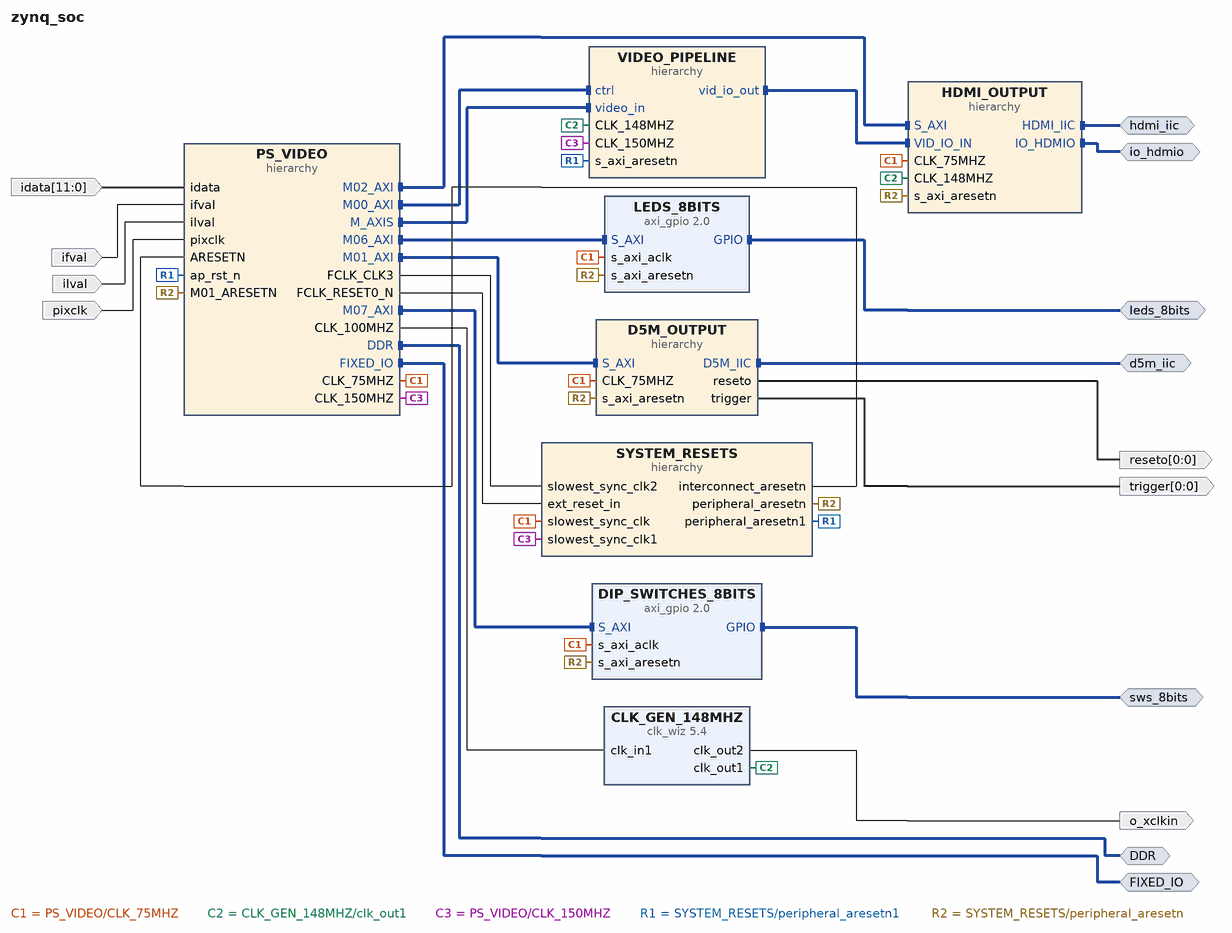
[diagram p0: block diagram of the top level]
# Vivado block design zynq_soc, xc7z020clg484-1, Vivado 2017.2
create_bd_design zynq_soc

create_bd_intf_port -mode Master -vlnv xilinx.com:interface:ddrx_rtl:1.0 DDR
create_bd_intf_port -mode Master -vlnv xilinx.com:display_processing_system7:fixedio_rtl:1.0 FIXED_IO
create_bd_intf_port -mode Master -vlnv xilinx.com:interface:iic_rtl:1.0 d5m_iic
create_bd_intf_port -mode Master -vlnv xilinx.com:interface:iic_rtl:1.0 hdmi_iic
create_bd_intf_port -mode Master -vlnv avnet.com:interface:avnet_hdmi_rtl:1.0 io_hdmio
create_bd_intf_port -mode Master -vlnv xilinx.com:interface:gpio_rtl:1.0 leds_8bits
create_bd_intf_port -mode Master -vlnv xilinx.com:interface:gpio_rtl:1.0 sws_8bits
create_bd_port -dir O o_xclkin
create_bd_port -dir O -from 0 -to 0 reseto
create_bd_port -dir O -from 0 -to 0 trigger
create_bd_port -dir I -from 11 -to 0 idata
create_bd_port -dir I ifval
create_bd_port -dir I ilval
create_bd_port -dir I pixclk

create_bd_cell -type ip -vlnv xilinx.com:ip:clk_wiz:5.4 CLK_GEN_148MHZ
set_property -dict [list \
  CONFIG.ENABLE_CLOCK_MONITOR false \
  CONFIG.PRIMITIVE MMCM \
  CONFIG.CLKOUT2_USED true \
  CONFIG.NUM_OUT_CLKS 2 \
  CONFIG.CLKOUT1_REQUESTED_OUT_FREQ 148.500 \
  CONFIG.CLKOUT2_REQUESTED_OUT_FREQ 24.000 \
  CONFIG.USE_LOCKED false \
  CONFIG.USE_RESET false \
  CONFIG.MMCM_DIVCLK_DIVIDE 3 \
  CONFIG.MMCM_CLKFBOUT_MULT_F 24.500 \
  CONFIG.MMCM_CLKOUT0_DIVIDE_F 5.500 \
  CONFIG.MMCM_CLKOUT1_DIVIDE 34 \
  CONFIG.CLK_IN1_BOARD_INTERFACE Custom \
  CONFIG.CLK_IN2_BOARD_INTERFACE Custom \
  CONFIG.RESET_BOARD_INTERFACE Custom \
  CONFIG.CLKOUT1_JITTER 202.854 \
  CONFIG.CLKOUT1_PHASE_ERROR 235.784 \
  CONFIG.CLKOUT2_JITTER 299.004 \
  CONFIG.CLKOUT2_PHASE_ERROR 235.784 \
] [get_bd_cells CLK_GEN_148MHZ]
create_bd_cell -type hier D5M_OUTPUT
create_bd_cell -type ip -vlnv xilinx.com:ip:axi_gpio:2.0 DIP_SWITCHES_8BITS
set_property -dict {CONFIG.USE_BOARD_FLOW true CONFIG.GPIO_BOARD_INTERFACE sws_8bits} [get_bd_cells DIP_SWITCHES_8BITS]
create_bd_cell -type hier HDMI_OUTPUT
create_bd_cell -type ip -vlnv xilinx.com:ip:axi_gpio:2.0 LEDS_8BITS
set_property -dict {CONFIG.USE_BOARD_FLOW true CONFIG.GPIO_BOARD_INTERFACE leds_8bits} [get_bd_cells LEDS_8BITS]
create_bd_cell -type hier PS_VIDEO
create_bd_cell -type hier SYSTEM_RESETS
create_bd_cell -type hier VIDEO_PIPELINE

# ---- hierarchy /D5M_OUTPUT ----
current_bd_instance /D5M_OUTPUT
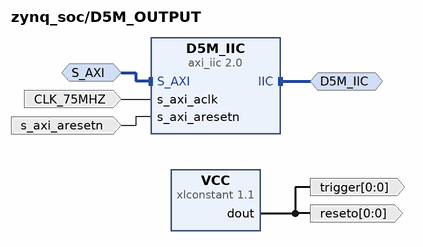
[diagram p1: block diagram inside /D5M_OUTPUT]
create_bd_intf_pin -mode Master -vlnv xilinx.com:interface:iic_rtl:1.0 D5M_IIC
create_bd_intf_pin -mode Slave -vlnv xilinx.com:interface:aximm_rtl:1.0 S_AXI
create_bd_pin -dir I -type clk CLK_75MHZ
create_bd_pin -dir O -from 0 -to 0 reseto
create_bd_pin -dir I -type rst s_axi_aresetn
create_bd_pin -dir O -from 0 -to 0 trigger

create_bd_cell -type ip -vlnv xilinx.com:ip:axi_iic:2.0 D5M_IIC
set_property -dict {CONFIG.IIC_FREQ_KHZ 400} [get_bd_cells D5M_IIC]
create_bd_cell -type ip -vlnv xilinx.com:ip:xlconstant:1.1 VCC
set_property -dict {CONFIG.CONST_VAL 1} [get_bd_cells VCC]

# ---- hierarchy /HDMI_OUTPUT ----
current_bd_instance /HDMI_OUTPUT
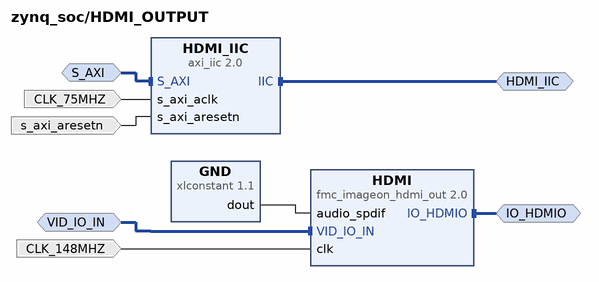
[diagram p2: block diagram inside /HDMI_OUTPUT]
create_bd_intf_pin -mode Master -vlnv xilinx.com:interface:iic_rtl:1.0 HDMI_IIC
create_bd_intf_pin -mode Master -vlnv avnet.com:interface:avnet_hdmi_rtl:1.0 IO_HDMIO
create_bd_intf_pin -mode Slave -vlnv xilinx.com:interface:aximm_rtl:1.0 S_AXI
create_bd_intf_pin -mode Slave -vlnv xilinx.com:interface:vid_io_rtl:1.0 VID_IO_IN
create_bd_pin -dir I CLK_148MHZ
create_bd_pin -dir I -type clk CLK_75MHZ
create_bd_pin -dir I -type rst s_axi_aresetn

create_bd_cell -type ip -vlnv xilinx.com:ip:xlconstant:1.1 GND
set_property -dict {CONFIG.CONST_VAL 0} [get_bd_cells GND]
create_bd_cell -type ip -vlnv ProjectTollgate:ProjectTollgate:fmc_imageon_hdmi_out:2.0 HDMI
set_property -dict {CONFIG.C_DEBUG_PORT false} [get_bd_cells HDMI]
create_bd_cell -type ip -vlnv xilinx.com:ip:axi_iic:2.0 HDMI_IIC

# ---- hierarchy /PS_VIDEO ----
current_bd_instance /PS_VIDEO
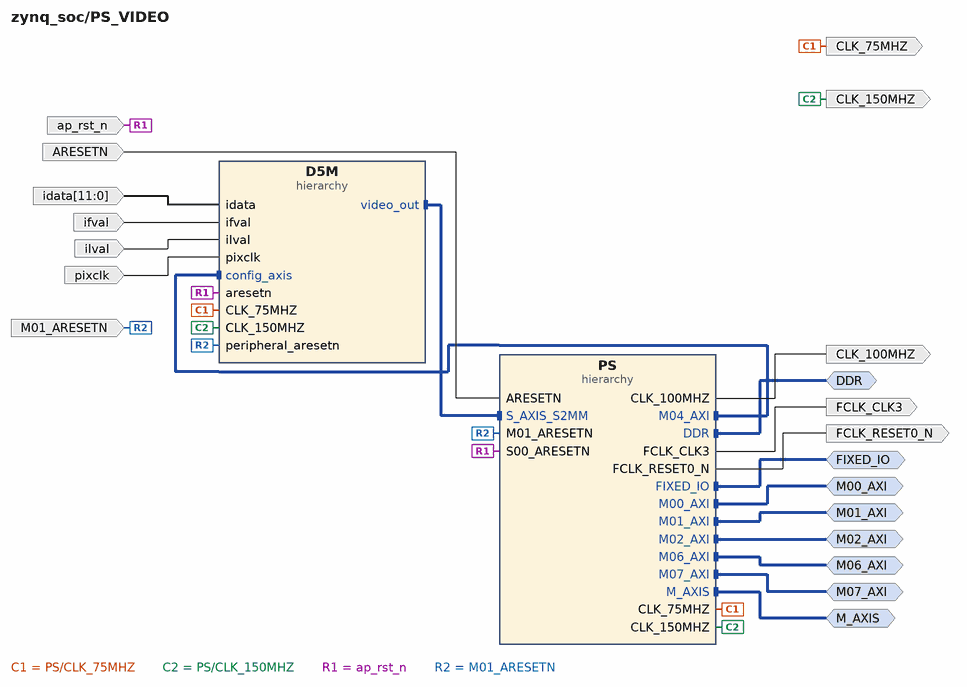
[diagram p3: block diagram inside /PS_VIDEO]
create_bd_intf_pin -mode Master -vlnv xilinx.com:interface:ddrx_rtl:1.0 DDR
create_bd_intf_pin -mode Master -vlnv xilinx.com:display_processing_system7:fixedio_rtl:1.0 FIXED_IO
create_bd_intf_pin -mode Master -vlnv xilinx.com:interface:aximm_rtl:1.0 M00_AXI
create_bd_intf_pin -mode Master -vlnv xilinx.com:interface:aximm_rtl:1.0 M01_AXI
create_bd_intf_pin -mode Master -vlnv xilinx.com:interface:aximm_rtl:1.0 M02_AXI
create_bd_intf_pin -mode Master -vlnv xilinx.com:interface:aximm_rtl:1.0 M06_AXI
create_bd_intf_pin -mode Master -vlnv xilinx.com:interface:aximm_rtl:1.0 M07_AXI
create_bd_intf_pin -mode Master -vlnv xilinx.com:interface:axis_rtl:1.0 M_AXIS
create_bd_pin -dir I -type rst ARESETN
create_bd_pin -dir O -type clk CLK_100MHZ
create_bd_pin -dir O -type clk CLK_150MHZ
create_bd_pin -dir O -type clk CLK_75MHZ
create_bd_pin -dir O -type clk FCLK_CLK3
create_bd_pin -dir O -type rst FCLK_RESET0_N
create_bd_pin -dir I -type rst M01_ARESETN
create_bd_pin -dir I -type rst ap_rst_n
create_bd_pin -dir I -from 11 -to 0 idata
create_bd_pin -dir I ifval
create_bd_pin -dir I ilval
create_bd_pin -dir I pixclk

create_bd_cell -type hier D5M
create_bd_cell -type hier PS

# ---- hierarchy /PS_VIDEO/D5M ----
current_bd_instance /PS_VIDEO/D5M
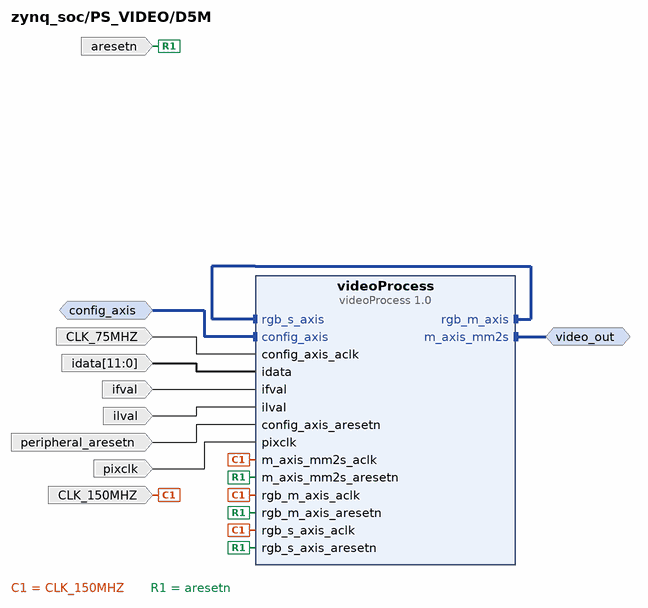
[diagram p4: block diagram inside /PS_VIDEO/D5M]
create_bd_intf_pin -mode Slave -vlnv xilinx.com:interface:aximm_rtl:1.0 config_axis
create_bd_intf_pin -mode Master -vlnv xilinx.com:interface:axis_rtl:1.0 video_out
create_bd_pin -dir I -type clk CLK_150MHZ
create_bd_pin -dir I -type clk CLK_75MHZ
create_bd_pin -dir I -type rst aresetn
create_bd_pin -dir I -from 11 -to 0 idata
create_bd_pin -dir I ifval
create_bd_pin -dir I ilval
create_bd_pin -dir I -type rst peripheral_aresetn
create_bd_pin -dir I pixclk

create_bd_cell -type ip -vlnv xilinx.com:user:videoProcess:1.0 videoProcess
set_property -dict {CONFIG.revision_number 0x10212018} [get_bd_cells videoProcess]

# ---- hierarchy /PS_VIDEO/PS ----
current_bd_instance /PS_VIDEO/PS
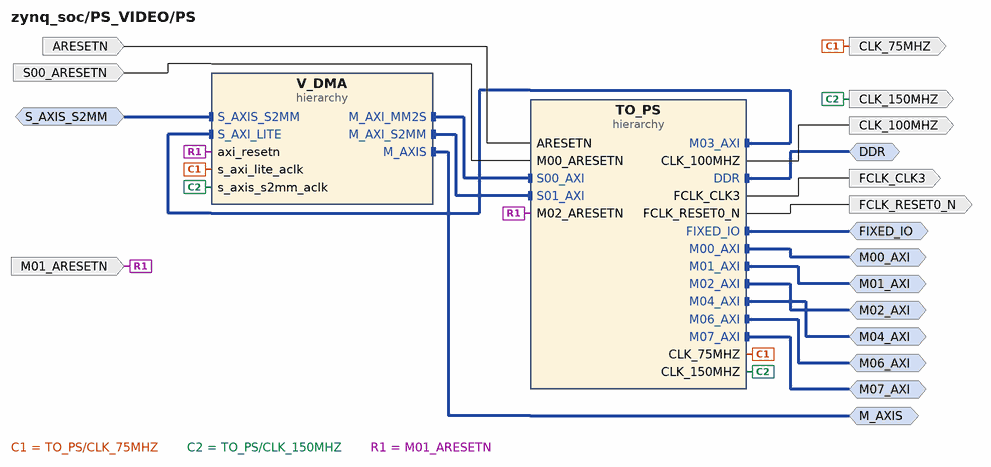
[diagram p5: block diagram inside /PS_VIDEO/PS]
create_bd_intf_pin -mode Master -vlnv xilinx.com:interface:ddrx_rtl:1.0 DDR
create_bd_intf_pin -mode Master -vlnv xilinx.com:display_processing_system7:fixedio_rtl:1.0 FIXED_IO
create_bd_intf_pin -mode Master -vlnv xilinx.com:interface:aximm_rtl:1.0 M00_AXI
create_bd_intf_pin -mode Master -vlnv xilinx.com:interface:aximm_rtl:1.0 M01_AXI
create_bd_intf_pin -mode Master -vlnv xilinx.com:interface:aximm_rtl:1.0 M02_AXI
create_bd_intf_pin -mode Master -vlnv xilinx.com:interface:aximm_rtl:1.0 M04_AXI
create_bd_intf_pin -mode Master -vlnv xilinx.com:interface:aximm_rtl:1.0 M06_AXI
create_bd_intf_pin -mode Master -vlnv xilinx.com:interface:aximm_rtl:1.0 M07_AXI
create_bd_intf_pin -mode Master -vlnv xilinx.com:interface:axis_rtl:1.0 M_AXIS
create_bd_intf_pin -mode Slave -vlnv xilinx.com:interface:axis_rtl:1.0 S_AXIS_S2MM
create_bd_pin -dir I -type rst ARESETN
create_bd_pin -dir O -type clk CLK_100MHZ
create_bd_pin -dir O -type clk CLK_150MHZ
create_bd_pin -dir O -type clk CLK_75MHZ
create_bd_pin -dir O -type clk FCLK_CLK3
create_bd_pin -dir O -type rst FCLK_RESET0_N
create_bd_pin -dir I -type rst M01_ARESETN
create_bd_pin -dir I -type rst S00_ARESETN

create_bd_cell -type hier TO_PS
create_bd_cell -type hier V_DMA

# ---- hierarchy /PS_VIDEO/PS/TO_PS ----
current_bd_instance /PS_VIDEO/PS/TO_PS
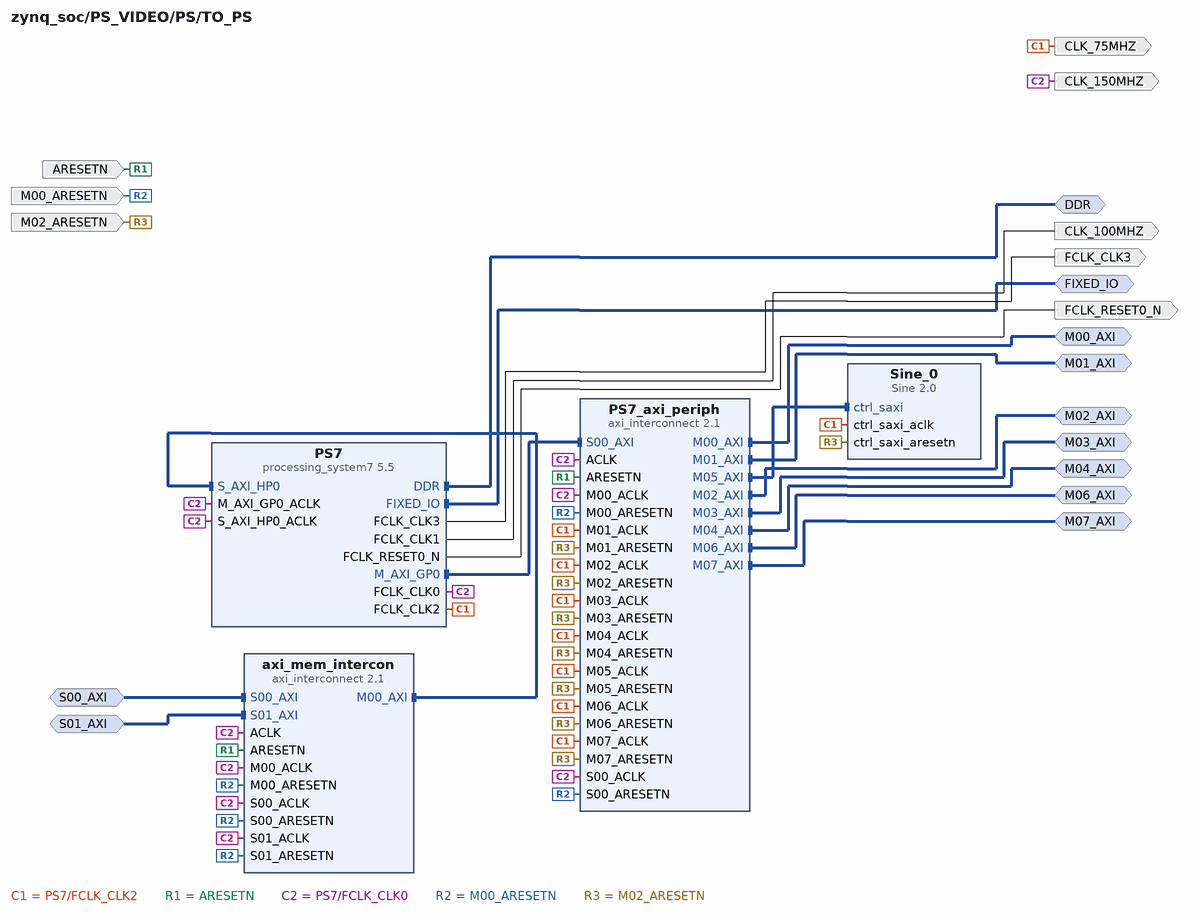
[diagram p6: block diagram inside /PS_VIDEO/PS/TO_PS]
create_bd_intf_pin -mode Master -vlnv xilinx.com:interface:ddrx_rtl:1.0 DDR
create_bd_intf_pin -mode Master -vlnv xilinx.com:display_processing_system7:fixedio_rtl:1.0 FIXED_IO
create_bd_intf_pin -mode Master -vlnv xilinx.com:interface:aximm_rtl:1.0 M00_AXI
create_bd_intf_pin -mode Master -vlnv xilinx.com:interface:aximm_rtl:1.0 M01_AXI
create_bd_intf_pin -mode Master -vlnv xilinx.com:interface:aximm_rtl:1.0 M02_AXI
create_bd_intf_pin -mode Master -vlnv xilinx.com:interface:aximm_rtl:1.0 M03_AXI
create_bd_intf_pin -mode Master -vlnv xilinx.com:interface:aximm_rtl:1.0 M04_AXI
create_bd_intf_pin -mode Master -vlnv xilinx.com:interface:aximm_rtl:1.0 M06_AXI
create_bd_intf_pin -mode Master -vlnv xilinx.com:interface:aximm_rtl:1.0 M07_AXI
create_bd_intf_pin -mode Slave -vlnv xilinx.com:interface:aximm_rtl:1.0 S00_AXI
create_bd_intf_pin -mode Slave -vlnv xilinx.com:interface:aximm_rtl:1.0 S01_AXI
create_bd_pin -dir I -type rst ARESETN
create_bd_pin -dir O -type clk CLK_100MHZ
create_bd_pin -dir O -type clk CLK_150MHZ
create_bd_pin -dir O -type clk CLK_75MHZ
create_bd_pin -dir O -type clk FCLK_CLK3
create_bd_pin -dir O -type rst FCLK_RESET0_N
create_bd_pin -dir I -type rst M00_ARESETN
create_bd_pin -dir I -type rst M02_ARESETN

create_bd_cell -type ip -vlnv xilinx.com:ip:processing_system7:5.5 PS7
set_property -dict [list \
  CONFIG.PCW_FCLK_CLK1_BUF TRUE \
  CONFIG.PCW_FCLK_CLK2_BUF TRUE \
  CONFIG.PCW_FCLK_CLK3_BUF TRUE \
  CONFIG.PCW_UIPARAM_DDR_FREQ_MHZ 533.333313 \
  CONFIG.PCW_APU_PERIPHERAL_FREQMHZ 666.666667 \
  CONFIG.PCW_SDIO_PERIPHERAL_FREQMHZ 50 \
  CONFIG.PCW_UART_PERIPHERAL_FREQMHZ 50 \
  CONFIG.PCW_FPGA0_PERIPHERAL_FREQMHZ 150.000000 \
  CONFIG.PCW_FPGA1_PERIPHERAL_FREQMHZ 100.000000 \
  CONFIG.PCW_FPGA2_PERIPHERAL_FREQMHZ 75.000000 \
  CONFIG.PCW_FPGA3_PERIPHERAL_FREQMHZ 25 \
  CONFIG.PCW_USE_S_AXI_HP0 1 \
  CONFIG.PCW_EN_CLK1_PORT 1 \
  CONFIG.PCW_EN_CLK2_PORT 1 \
  CONFIG.PCW_EN_CLK3_PORT 1 \
  CONFIG.PCW_PERIPHERAL_BOARD_PRESET part0 \
  CONFIG.PCW_PRESET_BANK1_VOLTAGE {LVCMOS 1.8V} \
  CONFIG.PCW_UIPARAM_DDR_PARTNO {MT41J128M16 HA-15E} \
  CONFIG.PCW_QSPI_PERIPHERAL_ENABLE 1 \
  CONFIG.PCW_QSPI_QSPI_IO {MIO 1 .. 6} \
  CONFIG.PCW_QSPI_GRP_SINGLE_SS_ENABLE 1 \
  CONFIG.PCW_QSPI_GRP_SINGLE_SS_IO {MIO 1 .. 6} \
  CONFIG.PCW_ENET0_PERIPHERAL_ENABLE 1 \
  CONFIG.PCW_ENET0_ENET0_IO {MIO 16 .. 27} \
  CONFIG.PCW_ENET0_GRP_MDIO_ENABLE 1 \
  CONFIG.PCW_ENET0_GRP_MDIO_IO {MIO 52 .. 53} \
  CONFIG.PCW_ENET_RESET_ENABLE 1 \
  CONFIG.PCW_ENET_RESET_SELECT {Share reset pin} \
  CONFIG.PCW_ENET0_RESET_ENABLE 0 \
  CONFIG.PCW_SD0_PERIPHERAL_ENABLE 1 \
  CONFIG.PCW_SD0_SD0_IO {MIO 40 .. 45} \
  CONFIG.PCW_SD0_GRP_CD_ENABLE 1 \
  CONFIG.PCW_SD0_GRP_CD_IO {MIO 47} \
  CONFIG.PCW_SD0_GRP_WP_ENABLE 1 \
  CONFIG.PCW_SD0_GRP_WP_IO {MIO 46} \
  CONFIG.PCW_UART1_PERIPHERAL_ENABLE 1 \
  CONFIG.PCW_UART1_UART1_IO {MIO 48 .. 49} \
  CONFIG.PCW_USB0_PERIPHERAL_ENABLE 0 \
  CONFIG.PCW_USB_RESET_ENABLE 1 \
  CONFIG.PCW_I2C_RESET_ENABLE 1 \
  CONFIG.PCW_GPIO_MIO_GPIO_ENABLE 1 \
  CONFIG.PCW_GPIO_MIO_GPIO_IO MIO \
  CONFIG.PCW_ENET1_PERIPHERAL_CLKSRC External \
  CONFIG.preset ZedBoard \
  CONFIG.PCW_FPGA_FCLK1_ENABLE 1 \
  CONFIG.PCW_FPGA_FCLK2_ENABLE 1 \
  CONFIG.PCW_FPGA_FCLK3_ENABLE 1 \
] [get_bd_cells PS7]
# 425 more settings of PS7 are not shown: defaults, MIO pin electricals, DDR timing, and values the tool derives
create_bd_cell -type ip -vlnv xilinx.com:ip:axi_interconnect:2.1 PS7_axi_periph
set_property -dict {CONFIG.NUM_MI 8} [get_bd_cells PS7_axi_periph]
create_bd_cell -type ip -vlnv xilinx.com:user:Sine:2.0 Sine_0
create_bd_cell -type ip -vlnv xilinx.com:ip:axi_interconnect:2.1 axi_mem_intercon
set_property -dict {CONFIG.NUM_SI 2 CONFIG.NUM_MI 1} [get_bd_cells axi_mem_intercon]

# ---- hierarchy /PS_VIDEO/PS/V_DMA ----
current_bd_instance /PS_VIDEO/PS/V_DMA
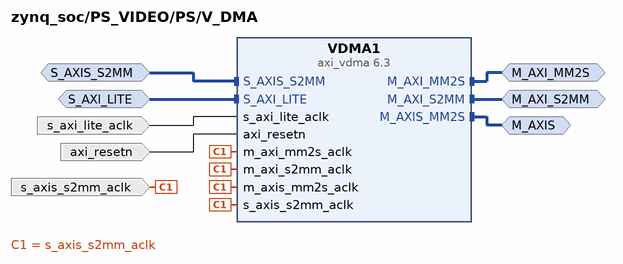
[diagram p7: block diagram inside /PS_VIDEO/PS/V_DMA]
create_bd_intf_pin -mode Master -vlnv xilinx.com:interface:axis_rtl:1.0 M_AXIS
create_bd_intf_pin -mode Master -vlnv xilinx.com:interface:aximm_rtl:1.0 M_AXI_MM2S
create_bd_intf_pin -mode Master -vlnv xilinx.com:interface:aximm_rtl:1.0 M_AXI_S2MM
create_bd_intf_pin -mode Slave -vlnv xilinx.com:interface:axis_rtl:1.0 S_AXIS_S2MM
create_bd_intf_pin -mode Slave -vlnv xilinx.com:interface:aximm_rtl:1.0 S_AXI_LITE
create_bd_pin -dir I -type rst axi_resetn
create_bd_pin -dir I -type clk s_axi_lite_aclk
create_bd_pin -dir I -type clk s_axis_s2mm_aclk

create_bd_cell -type ip -vlnv xilinx.com:ip:axi_vdma:6.3 VDMA1
set_property -dict [list \
  CONFIG.c_m_axis_mm2s_tdata_width 16 \
  CONFIG.c_include_s2mm_dre 1 \
  CONFIG.c_num_fstores 3 \
  CONFIG.c_use_s2mm_fsync 2 \
  CONFIG.c_mm2s_genlock_mode 1 \
  CONFIG.c_s2mm_genlock_mode 0 \
  CONFIG.c_mm2s_linebuffer_depth 512 \
  CONFIG.c_s2mm_linebuffer_depth 2048 \
  CONFIG.c_mm2s_max_burst_length 32 \
  CONFIG.c_s2mm_max_burst_length 8 \
  CONFIG.c_include_mm2s_dre 1 \
] [get_bd_cells VDMA1]

# ---- hierarchy /SYSTEM_RESETS ----
current_bd_instance /SYSTEM_RESETS
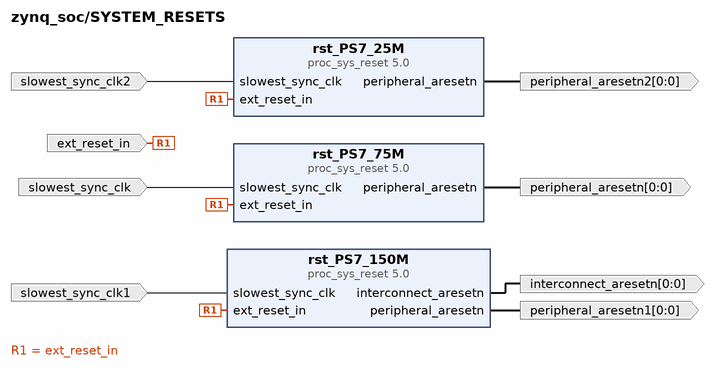
[diagram p8: block diagram inside /SYSTEM_RESETS]
create_bd_pin -dir I -type rst ext_reset_in
create_bd_pin -dir O -from 0 -to 0 -type rst interconnect_aresetn
create_bd_pin -dir O -from 0 -to 0 -type rst peripheral_aresetn
create_bd_pin -dir O -from 0 -to 0 -type rst peripheral_aresetn1
create_bd_pin -dir O -from 0 -to 0 -type rst peripheral_aresetn2
create_bd_pin -dir I -type clk slowest_sync_clk
create_bd_pin -dir I -type clk slowest_sync_clk1
create_bd_pin -dir I -type clk slowest_sync_clk2

create_bd_cell -type ip -vlnv xilinx.com:ip:proc_sys_reset:5.0 rst_PS7_150M
create_bd_cell -type ip -vlnv xilinx.com:ip:proc_sys_reset:5.0 rst_PS7_25M
create_bd_cell -type ip -vlnv xilinx.com:ip:proc_sys_reset:5.0 rst_PS7_75M

# ---- hierarchy /VIDEO_PIPELINE ----
current_bd_instance /VIDEO_PIPELINE
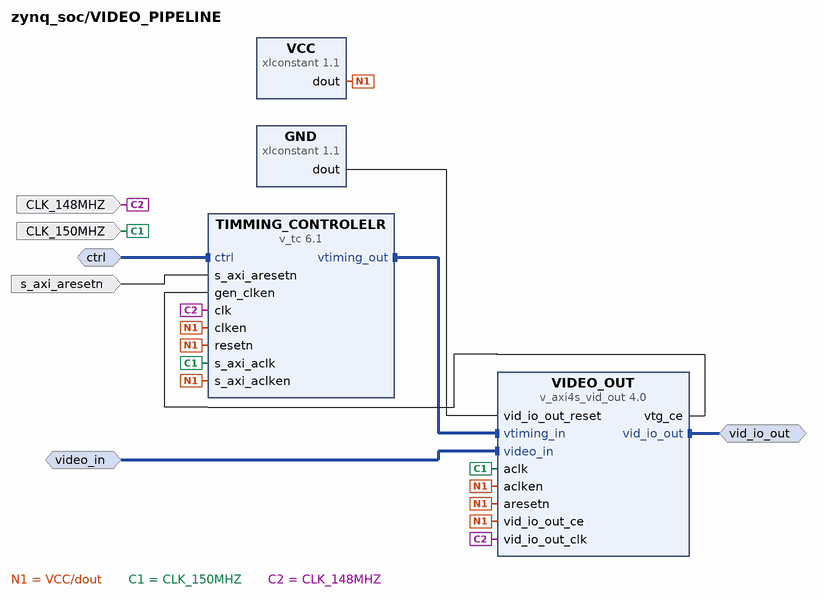
[diagram p9: block diagram inside /VIDEO_PIPELINE]
create_bd_intf_pin -mode Slave -vlnv xilinx.com:interface:aximm_rtl:1.0 ctrl
create_bd_intf_pin -mode Master -vlnv xilinx.com:interface:vid_io_rtl:1.0 vid_io_out
create_bd_intf_pin -mode Slave -vlnv xilinx.com:interface:axis_rtl:1.0 video_in
create_bd_pin -dir I -type clk CLK_148MHZ
create_bd_pin -dir I -type clk CLK_150MHZ
create_bd_pin -dir I -type rst s_axi_aresetn

create_bd_cell -type ip -vlnv xilinx.com:ip:xlconstant:1.1 GND
set_property -dict {CONFIG.CONST_VAL 0} [get_bd_cells GND]
create_bd_cell -type ip -vlnv xilinx.com:ip:v_tc:6.1 TIMMING_CONTROLELR
set_property -dict [list \
  CONFIG.HAS_INTC_IF false \
  CONFIG.INTERLACE_EN false \
  CONFIG.VIDEO_MODE 1080p \
  CONFIG.enable_detection false \
  CONFIG.enable_generation true \
] [get_bd_cells TIMMING_CONTROLELR]
create_bd_cell -type ip -vlnv xilinx.com:ip:xlconstant:1.1 VCC
set_property -dict {CONFIG.CONST_VAL 1} [get_bd_cells VCC]
create_bd_cell -type ip -vlnv xilinx.com:ip:v_axi4s_vid_out:4.0 VIDEO_OUT
set_property -dict [list \
  CONFIG.C_S_AXIS_VIDEO_FORMAT 0 \
  CONFIG.C_S_AXIS_VIDEO_DATA_WIDTH 8 \
  CONFIG.C_HAS_ASYNC_CLK 1 \
  CONFIG.C_VTG_MASTER_SLAVE 1 \
] [get_bd_cells VIDEO_OUT]

# ---- connections ----

current_bd_instance /D5M_OUTPUT
connect_bd_intf_net [get_bd_intf_pins D5M_IIC] [get_bd_intf_pins D5M_IIC/IIC]
connect_bd_intf_net [get_bd_intf_pins S_AXI] [get_bd_intf_pins D5M_IIC/S_AXI]
connect_bd_net [get_bd_pins VCC/dout] [get_bd_pins trigger] [get_bd_pins reseto]
connect_bd_net -net s_axi_aclk_1 [get_bd_pins CLK_75MHZ] [get_bd_pins D5M_IIC/s_axi_aclk]
connect_bd_net [get_bd_pins s_axi_aresetn] [get_bd_pins D5M_IIC/s_axi_aresetn]

current_bd_instance /HDMI_OUTPUT
connect_bd_intf_net [get_bd_intf_pins HDMI_IIC] [get_bd_intf_pins HDMI_IIC/IIC]
connect_bd_intf_net [get_bd_intf_pins IO_HDMIO] [get_bd_intf_pins HDMI/IO_HDMIO]
connect_bd_intf_net [get_bd_intf_pins S_AXI] [get_bd_intf_pins HDMI_IIC/S_AXI]
connect_bd_intf_net -intf_net VIDEO_PIPELINE_vid_io_out [get_bd_intf_pins VID_IO_IN] [get_bd_intf_pins HDMI/VID_IO_IN]
connect_bd_net [get_bd_pins GND/dout] [get_bd_pins HDMI/audio_spdif]
connect_bd_net -net clk_wiz_0_clk_out1 [get_bd_pins CLK_148MHZ] [get_bd_pins HDMI/clk]
connect_bd_net -net s_axi_aclk_1 [get_bd_pins CLK_75MHZ] [get_bd_pins HDMI_IIC/s_axi_aclk]
connect_bd_net [get_bd_pins s_axi_aresetn] [get_bd_pins HDMI_IIC/s_axi_aresetn]

current_bd_instance /PS_VIDEO
connect_bd_intf_net [get_bd_intf_pins D5M/config_axis] [get_bd_intf_pins PS/M04_AXI]
connect_bd_intf_net -intf_net v_ccm_0_video_out [get_bd_intf_pins D5M/video_out] [get_bd_intf_pins PS/S_AXIS_S2MM]
connect_bd_intf_net -intf_net PS_VIDEO_DDR [get_bd_intf_pins DDR] [get_bd_intf_pins PS/DDR]
connect_bd_intf_net -intf_net PS_VIDEO_FIXED_IO [get_bd_intf_pins FIXED_IO] [get_bd_intf_pins PS/FIXED_IO]
connect_bd_intf_net [get_bd_intf_pins M00_AXI] [get_bd_intf_pins PS/M00_AXI]
connect_bd_intf_net [get_bd_intf_pins M01_AXI] [get_bd_intf_pins PS/M01_AXI]
connect_bd_intf_net [get_bd_intf_pins M02_AXI] [get_bd_intf_pins PS/M02_AXI]
connect_bd_intf_net [get_bd_intf_pins M06_AXI] [get_bd_intf_pins PS/M06_AXI]
connect_bd_intf_net [get_bd_intf_pins M07_AXI] [get_bd_intf_pins PS/M07_AXI]
connect_bd_intf_net -intf_net PS_VIDEO_M_AXIS [get_bd_intf_pins M_AXIS] [get_bd_intf_pins PS/M_AXIS]
connect_bd_net -net PS7_FCLK_CLK2 [get_bd_pins PS/CLK_75MHZ] [get_bd_pins CLK_75MHZ] [get_bd_pins D5M/CLK_75MHZ]
connect_bd_net [get_bd_pins PS/FCLK_CLK3] [get_bd_pins FCLK_CLK3]
connect_bd_net -net PS_VIDEO_FCLK_CLK1 [get_bd_pins PS/CLK_100MHZ] [get_bd_pins CLK_100MHZ]
connect_bd_net -net PS_VIDEO_FCLK_RESET0_N [get_bd_pins PS/FCLK_RESET0_N] [get_bd_pins FCLK_RESET0_N]
connect_bd_net -net SYSTEM_RESETS_interconnect_aresetn [get_bd_pins ARESETN] [get_bd_pins PS/ARESETN]
connect_bd_net [get_bd_pins idata] [get_bd_pins D5M/idata]
connect_bd_net [get_bd_pins ifval] [get_bd_pins D5M/ifval]
connect_bd_net [get_bd_pins ilval] [get_bd_pins D5M/ilval]
connect_bd_net [get_bd_pins pixclk] [get_bd_pins D5M/pixclk]
connect_bd_net -net processing_system7_0_FCLK_CLK0 [get_bd_pins PS/CLK_150MHZ] [get_bd_pins CLK_150MHZ] [get_bd_pins D5M/CLK_150MHZ]
connect_bd_net -net rst_PS7_150M_peripheral_aresetn [get_bd_pins ap_rst_n] [get_bd_pins D5M/aresetn] [get_bd_pins PS/S00_ARESETN]
connect_bd_net -net rst_PS7_75M_peripheral_aresetn [get_bd_pins M01_ARESETN] [get_bd_pins D5M/peripheral_aresetn] [get_bd_pins PS/M01_ARESETN]

current_bd_instance /PS_VIDEO/D5M
connect_bd_intf_net -intf_net videoProcess_0_rgb_m_axis [get_bd_intf_pins videoProcess/rgb_m_axis] [get_bd_intf_pins videoProcess/rgb_s_axis]
connect_bd_intf_net [get_bd_intf_pins config_axis] [get_bd_intf_pins videoProcess/config_axis]
connect_bd_intf_net -intf_net videoProcess_0_m_axis_mm2s [get_bd_intf_pins video_out] [get_bd_intf_pins videoProcess/m_axis_mm2s]
connect_bd_net [get_bd_pins CLK_75MHZ] [get_bd_pins videoProcess/config_axis_aclk]
connect_bd_net [get_bd_pins idata] [get_bd_pins videoProcess/idata]
connect_bd_net [get_bd_pins ifval] [get_bd_pins videoProcess/ifval]
connect_bd_net [get_bd_pins ilval] [get_bd_pins videoProcess/ilval]
connect_bd_net [get_bd_pins peripheral_aresetn] [get_bd_pins videoProcess/config_axis_aresetn]
connect_bd_net [get_bd_pins pixclk] [get_bd_pins videoProcess/pixclk]
connect_bd_net -net processing_system7_0_FCLK_CLK0 [get_bd_pins CLK_150MHZ] \
  [get_bd_pins videoProcess/m_axis_mm2s_aclk] [get_bd_pins videoProcess/rgb_m_axis_aclk] \
  [get_bd_pins videoProcess/rgb_s_axis_aclk]
connect_bd_net -net rst_PS7_150M_peripheral_aresetn [get_bd_pins aresetn] \
  [get_bd_pins videoProcess/m_axis_mm2s_aresetn] [get_bd_pins videoProcess/rgb_m_axis_aresetn] \
  [get_bd_pins videoProcess/rgb_s_axis_aresetn]

current_bd_instance /PS_VIDEO/PS
connect_bd_intf_net [get_bd_intf_pins TO_PS/M03_AXI] [get_bd_intf_pins V_DMA/S_AXI_LITE]
connect_bd_intf_net -intf_net VDMA1_M_AXI_MM2S [get_bd_intf_pins TO_PS/S00_AXI] [get_bd_intf_pins V_DMA/M_AXI_MM2S]
connect_bd_intf_net -intf_net VDMA1_M_AXI_S2MM [get_bd_intf_pins TO_PS/S01_AXI] [get_bd_intf_pins V_DMA/M_AXI_S2MM]
connect_bd_intf_net -intf_net PS_VIDEO_DDR [get_bd_intf_pins DDR] [get_bd_intf_pins TO_PS/DDR]
connect_bd_intf_net -intf_net PS_VIDEO_FIXED_IO [get_bd_intf_pins FIXED_IO] [get_bd_intf_pins TO_PS/FIXED_IO]
connect_bd_intf_net [get_bd_intf_pins M00_AXI] [get_bd_intf_pins TO_PS/M00_AXI]
connect_bd_intf_net [get_bd_intf_pins M01_AXI] [get_bd_intf_pins TO_PS/M01_AXI]
connect_bd_intf_net [get_bd_intf_pins M02_AXI] [get_bd_intf_pins TO_PS/M02_AXI]
connect_bd_intf_net [get_bd_intf_pins M04_AXI] [get_bd_intf_pins TO_PS/M04_AXI]
connect_bd_intf_net [get_bd_intf_pins M06_AXI] [get_bd_intf_pins TO_PS/M06_AXI]
connect_bd_intf_net [get_bd_intf_pins M07_AXI] [get_bd_intf_pins TO_PS/M07_AXI]
connect_bd_intf_net -intf_net PS_VIDEO_M_AXIS [get_bd_intf_pins M_AXIS] [get_bd_intf_pins V_DMA/M_AXIS]
connect_bd_intf_net -intf_net v_ccm_0_video_out [get_bd_intf_pins S_AXIS_S2MM] [get_bd_intf_pins V_DMA/S_AXIS_S2MM]
connect_bd_net -net PS7_FCLK_CLK2 [get_bd_pins TO_PS/CLK_75MHZ] [get_bd_pins CLK_75MHZ] [get_bd_pins V_DMA/s_axi_lite_aclk]
connect_bd_net -net PS_VIDEO_FCLK_CLK1 [get_bd_pins TO_PS/CLK_100MHZ] [get_bd_pins CLK_100MHZ]
connect_bd_net -net PS_VIDEO_FCLK_RESET0_N [get_bd_pins TO_PS/FCLK_RESET0_N] [get_bd_pins FCLK_RESET0_N]
connect_bd_net -net SYSTEM_RESETS_interconnect_aresetn [get_bd_pins ARESETN] [get_bd_pins TO_PS/ARESETN]
connect_bd_net [get_bd_pins TO_PS/FCLK_CLK3] [get_bd_pins FCLK_CLK3]
connect_bd_net -net processing_system7_0_FCLK_CLK0 [get_bd_pins TO_PS/CLK_150MHZ] [get_bd_pins CLK_150MHZ] [get_bd_pins V_DMA/s_axis_s2mm_aclk]
connect_bd_net -net rst_PS7_150M_peripheral_aresetn [get_bd_pins S00_ARESETN] [get_bd_pins TO_PS/M00_ARESETN]
connect_bd_net -net rst_PS7_75M_peripheral_aresetn [get_bd_pins M01_ARESETN] [get_bd_pins TO_PS/M02_ARESETN] [get_bd_pins V_DMA/axi_resetn]

current_bd_instance /PS_VIDEO/PS/TO_PS
connect_bd_intf_net [get_bd_intf_pins PS7/M_AXI_GP0] [get_bd_intf_pins PS7_axi_periph/S00_AXI]
connect_bd_intf_net [get_bd_intf_pins PS7_axi_periph/M05_AXI] [get_bd_intf_pins Sine_0/ctrl_saxi]
connect_bd_intf_net [get_bd_intf_pins PS7/S_AXI_HP0] [get_bd_intf_pins axi_mem_intercon/M00_AXI]
connect_bd_intf_net -intf_net PS_VIDEO_DDR [get_bd_intf_pins DDR] [get_bd_intf_pins PS7/DDR]
connect_bd_intf_net -intf_net PS_VIDEO_FIXED_IO [get_bd_intf_pins FIXED_IO] [get_bd_intf_pins PS7/FIXED_IO]
connect_bd_intf_net [get_bd_intf_pins M00_AXI] [get_bd_intf_pins PS7_axi_periph/M00_AXI]
connect_bd_intf_net [get_bd_intf_pins M01_AXI] [get_bd_intf_pins PS7_axi_periph/M01_AXI]
connect_bd_intf_net [get_bd_intf_pins M02_AXI] [get_bd_intf_pins PS7_axi_periph/M02_AXI]
connect_bd_intf_net [get_bd_intf_pins M03_AXI] [get_bd_intf_pins PS7_axi_periph/M03_AXI]
connect_bd_intf_net [get_bd_intf_pins M04_AXI] [get_bd_intf_pins PS7_axi_periph/M04_AXI]
connect_bd_intf_net [get_bd_intf_pins M06_AXI] [get_bd_intf_pins PS7_axi_periph/M06_AXI]
connect_bd_intf_net [get_bd_intf_pins M07_AXI] [get_bd_intf_pins PS7_axi_periph/M07_AXI]
connect_bd_intf_net -intf_net VDMA1_M_AXI_MM2S [get_bd_intf_pins S00_AXI] [get_bd_intf_pins axi_mem_intercon/S00_AXI]
connect_bd_intf_net -intf_net VDMA1_M_AXI_S2MM [get_bd_intf_pins S01_AXI] [get_bd_intf_pins axi_mem_intercon/S01_AXI]
connect_bd_net [get_bd_pins PS7/FCLK_CLK2] \
  [get_bd_pins CLK_75MHZ] [get_bd_pins Sine_0/ctrl_saxi_aclk] [get_bd_pins PS7_axi_periph/M01_ACLK] \
  [get_bd_pins PS7_axi_periph/M02_ACLK] [get_bd_pins PS7_axi_periph/M03_ACLK] [get_bd_pins PS7_axi_periph/M04_ACLK] \
  [get_bd_pins PS7_axi_periph/M05_ACLK] [get_bd_pins PS7_axi_periph/M06_ACLK] [get_bd_pins PS7_axi_periph/M07_ACLK]
connect_bd_net [get_bd_pins PS7/FCLK_CLK3] [get_bd_pins FCLK_CLK3]
connect_bd_net -net PS_VIDEO_FCLK_CLK1 [get_bd_pins PS7/FCLK_CLK1] [get_bd_pins CLK_100MHZ]
connect_bd_net -net PS_VIDEO_FCLK_RESET0_N [get_bd_pins PS7/FCLK_RESET0_N] [get_bd_pins FCLK_RESET0_N]
connect_bd_net -net SYSTEM_RESETS_interconnect_aresetn [get_bd_pins ARESETN] \
  [get_bd_pins PS7_axi_periph/ARESETN] [get_bd_pins axi_mem_intercon/ARESETN]
connect_bd_net -net processing_system7_0_FCLK_CLK0 [get_bd_pins PS7/FCLK_CLK0] \
  [get_bd_pins CLK_150MHZ] [get_bd_pins PS7/M_AXI_GP0_ACLK] [get_bd_pins PS7/S_AXI_HP0_ACLK] \
  [get_bd_pins PS7_axi_periph/ACLK] [get_bd_pins PS7_axi_periph/M00_ACLK] [get_bd_pins PS7_axi_periph/S00_ACLK] \
  [get_bd_pins axi_mem_intercon/ACLK] [get_bd_pins axi_mem_intercon/M00_ACLK] [get_bd_pins axi_mem_intercon/S00_ACLK] \
  [get_bd_pins axi_mem_intercon/S01_ACLK]
connect_bd_net -net rst_PS7_150M_peripheral_aresetn [get_bd_pins M00_ARESETN] \
  [get_bd_pins PS7_axi_periph/M00_ARESETN] [get_bd_pins PS7_axi_periph/S00_ARESETN] \
  [get_bd_pins axi_mem_intercon/M00_ARESETN] [get_bd_pins axi_mem_intercon/S00_ARESETN] \
  [get_bd_pins axi_mem_intercon/S01_ARESETN]
connect_bd_net -net rst_PS7_75M_peripheral_aresetn [get_bd_pins M02_ARESETN] \
  [get_bd_pins Sine_0/ctrl_saxi_aresetn] [get_bd_pins PS7_axi_periph/M01_ARESETN] [get_bd_pins PS7_axi_periph/M02_ARESETN] \
  [get_bd_pins PS7_axi_periph/M03_ARESETN] [get_bd_pins PS7_axi_periph/M04_ARESETN] [get_bd_pins PS7_axi_periph/M05_ARESETN] \
  [get_bd_pins PS7_axi_periph/M06_ARESETN] [get_bd_pins PS7_axi_periph/M07_ARESETN]

current_bd_instance /PS_VIDEO/PS/V_DMA
connect_bd_intf_net [get_bd_intf_pins M_AXIS] [get_bd_intf_pins VDMA1/M_AXIS_MM2S]
connect_bd_intf_net [get_bd_intf_pins M_AXI_MM2S] [get_bd_intf_pins VDMA1/M_AXI_MM2S]
connect_bd_intf_net [get_bd_intf_pins M_AXI_S2MM] [get_bd_intf_pins VDMA1/M_AXI_S2MM]
connect_bd_intf_net -intf_net v_ccm_0_video_out [get_bd_intf_pins S_AXIS_S2MM] [get_bd_intf_pins VDMA1/S_AXIS_S2MM]
connect_bd_intf_net [get_bd_intf_pins S_AXI_LITE] [get_bd_intf_pins VDMA1/S_AXI_LITE]
connect_bd_net -net PS7_FCLK_CLK2 [get_bd_pins s_axi_lite_aclk] [get_bd_pins VDMA1/s_axi_lite_aclk]
connect_bd_net -net processing_system7_0_FCLK_CLK0 [get_bd_pins s_axis_s2mm_aclk] \
  [get_bd_pins VDMA1/m_axi_mm2s_aclk] [get_bd_pins VDMA1/m_axi_s2mm_aclk] [get_bd_pins VDMA1/m_axis_mm2s_aclk] \
  [get_bd_pins VDMA1/s_axis_s2mm_aclk]
connect_bd_net -net rst_PS7_75M_peripheral_aresetn [get_bd_pins axi_resetn] [get_bd_pins VDMA1/axi_resetn]

current_bd_instance /SYSTEM_RESETS
connect_bd_net -net PS7_FCLK_CLK2 [get_bd_pins slowest_sync_clk] [get_bd_pins rst_PS7_75M/slowest_sync_clk]
connect_bd_net -net PS_VIDEO_FCLK_RESET0_N [get_bd_pins ext_reset_in] \
  [get_bd_pins rst_PS7_150M/ext_reset_in] [get_bd_pins rst_PS7_25M/ext_reset_in] [get_bd_pins rst_PS7_75M/ext_reset_in]
connect_bd_net -net processing_system7_0_FCLK_CLK0 [get_bd_pins slowest_sync_clk1] [get_bd_pins rst_PS7_150M/slowest_sync_clk]
connect_bd_net [get_bd_pins rst_PS7_150M/interconnect_aresetn] [get_bd_pins interconnect_aresetn]
connect_bd_net [get_bd_pins rst_PS7_150M/peripheral_aresetn] [get_bd_pins peripheral_aresetn1]
connect_bd_net [get_bd_pins rst_PS7_25M/peripheral_aresetn] [get_bd_pins peripheral_aresetn2]
connect_bd_net [get_bd_pins rst_PS7_75M/peripheral_aresetn] [get_bd_pins peripheral_aresetn]
connect_bd_net -net slowest_sync_clk2_1 [get_bd_pins slowest_sync_clk2] [get_bd_pins rst_PS7_25M/slowest_sync_clk]

current_bd_instance /VIDEO_PIPELINE
connect_bd_intf_net [get_bd_intf_pins TIMMING_CONTROLELR/vtiming_out] [get_bd_intf_pins VIDEO_OUT/vtiming_in]
connect_bd_intf_net [get_bd_intf_pins ctrl] [get_bd_intf_pins TIMMING_CONTROLELR/ctrl]
connect_bd_intf_net [get_bd_intf_pins vid_io_out] [get_bd_intf_pins VIDEO_OUT/vid_io_out]
connect_bd_intf_net [get_bd_intf_pins video_in] [get_bd_intf_pins VIDEO_OUT/video_in]
connect_bd_net [get_bd_pins GND/dout] [get_bd_pins VIDEO_OUT/vid_io_out_reset]
connect_bd_net [get_bd_pins VCC/dout] \
  [get_bd_pins TIMMING_CONTROLELR/clken] [get_bd_pins TIMMING_CONTROLELR/resetn] \
  [get_bd_pins TIMMING_CONTROLELR/s_axi_aclken] [get_bd_pins VIDEO_OUT/aclken] [get_bd_pins VIDEO_OUT/aresetn] \
  [get_bd_pins VIDEO_OUT/vid_io_out_ce]
connect_bd_net [get_bd_pins VIDEO_OUT/vtg_ce] [get_bd_pins TIMMING_CONTROLELR/gen_clken]
connect_bd_net -net aclk_1 [get_bd_pins CLK_150MHZ] [get_bd_pins TIMMING_CONTROLELR/s_axi_aclk] [get_bd_pins VIDEO_OUT/aclk]
connect_bd_net [get_bd_pins s_axi_aresetn] [get_bd_pins TIMMING_CONTROLELR/s_axi_aresetn]
connect_bd_net -net vid_io_out_clk_1 [get_bd_pins CLK_148MHZ] [get_bd_pins TIMMING_CONTROLELR/clk] [get_bd_pins VIDEO_OUT/vid_io_out_clk]

current_bd_instance /
connect_bd_intf_net [get_bd_intf_pins PS_VIDEO/M00_AXI] [get_bd_intf_pins VIDEO_PIPELINE/ctrl]
connect_bd_intf_net [get_bd_intf_pins D5M_OUTPUT/S_AXI] [get_bd_intf_pins PS_VIDEO/M01_AXI]
connect_bd_intf_net [get_bd_intf_pins HDMI_OUTPUT/S_AXI] [get_bd_intf_pins PS_VIDEO/M02_AXI]
connect_bd_intf_net [get_bd_intf_pins LEDS_8BITS/S_AXI] [get_bd_intf_pins PS_VIDEO/M06_AXI]
connect_bd_intf_net [get_bd_intf_pins DIP_SWITCHES_8BITS/S_AXI] [get_bd_intf_pins PS_VIDEO/M07_AXI]
connect_bd_intf_net [get_bd_intf_pins PS_VIDEO/M_AXIS] [get_bd_intf_pins VIDEO_PIPELINE/video_in]
connect_bd_intf_net [get_bd_intf_pins HDMI_OUTPUT/VID_IO_IN] [get_bd_intf_pins VIDEO_PIPELINE/vid_io_out]
connect_bd_intf_net [get_bd_intf_ports DDR] [get_bd_intf_pins PS_VIDEO/DDR]
connect_bd_intf_net [get_bd_intf_ports FIXED_IO] [get_bd_intf_pins PS_VIDEO/FIXED_IO]
connect_bd_intf_net -intf_net D5M_OUTPUT_IIC [get_bd_intf_ports d5m_iic] [get_bd_intf_pins D5M_OUTPUT/D5M_IIC]
connect_bd_intf_net -intf_net HDMI_OUTPUT_IIC [get_bd_intf_ports hdmi_iic] [get_bd_intf_pins HDMI_OUTPUT/HDMI_IIC]
connect_bd_intf_net [get_bd_intf_ports io_hdmio] [get_bd_intf_pins HDMI_OUTPUT/IO_HDMIO]
connect_bd_intf_net -intf_net axi_gpio_0_GPIO [get_bd_intf_ports leds_8bits] [get_bd_intf_pins LEDS_8BITS/GPIO]
connect_bd_intf_net [get_bd_intf_ports sws_8bits] [get_bd_intf_pins DIP_SWITCHES_8BITS/GPIO]
connect_bd_net [get_bd_pins CLK_GEN_148MHZ/clk_out2] [get_bd_ports o_xclkin]
connect_bd_net [get_bd_pins D5M_OUTPUT/reseto] [get_bd_ports reseto]
connect_bd_net [get_bd_pins D5M_OUTPUT/trigger] [get_bd_ports trigger]
connect_bd_net -net PS7_FCLK_CLK2 [get_bd_pins PS_VIDEO/CLK_75MHZ] \
  [get_bd_pins DIP_SWITCHES_8BITS/s_axi_aclk] [get_bd_pins LEDS_8BITS/s_axi_aclk] [get_bd_pins D5M_OUTPUT/CLK_75MHZ] \
  [get_bd_pins HDMI_OUTPUT/CLK_75MHZ] [get_bd_pins SYSTEM_RESETS/slowest_sync_clk]
connect_bd_net -net PS_VIDEO_FCLK_CLK1 [get_bd_pins PS_VIDEO/CLK_100MHZ] [get_bd_pins CLK_GEN_148MHZ/clk_in1]
connect_bd_net [get_bd_pins PS_VIDEO/FCLK_CLK3] [get_bd_pins SYSTEM_RESETS/slowest_sync_clk2]
connect_bd_net [get_bd_pins PS_VIDEO/FCLK_RESET0_N] [get_bd_pins SYSTEM_RESETS/ext_reset_in]
connect_bd_net [get_bd_pins SYSTEM_RESETS/interconnect_aresetn] [get_bd_pins PS_VIDEO/ARESETN]
connect_bd_net -net clk_wiz_0_clk_out1 [get_bd_pins CLK_GEN_148MHZ/clk_out1] \
  [get_bd_pins HDMI_OUTPUT/CLK_148MHZ] [get_bd_pins VIDEO_PIPELINE/CLK_148MHZ]
connect_bd_net [get_bd_ports idata] [get_bd_pins PS_VIDEO/idata]
connect_bd_net [get_bd_ports ifval] [get_bd_pins PS_VIDEO/ifval]
connect_bd_net [get_bd_ports ilval] [get_bd_pins PS_VIDEO/ilval]
connect_bd_net [get_bd_ports pixclk] [get_bd_pins PS_VIDEO/pixclk]
connect_bd_net -net processing_system7_0_FCLK_CLK0 [get_bd_pins PS_VIDEO/CLK_150MHZ] \
  [get_bd_pins SYSTEM_RESETS/slowest_sync_clk1] [get_bd_pins VIDEO_PIPELINE/CLK_150MHZ]
connect_bd_net -net rst_PS7_150M_peripheral_aresetn [get_bd_pins SYSTEM_RESETS/peripheral_aresetn1] \
  [get_bd_pins PS_VIDEO/ap_rst_n] [get_bd_pins VIDEO_PIPELINE/s_axi_aresetn]
connect_bd_net -net rst_PS7_75M_peripheral_aresetn [get_bd_pins SYSTEM_RESETS/peripheral_aresetn] \
  [get_bd_pins DIP_SWITCHES_8BITS/s_axi_aresetn] [get_bd_pins LEDS_8BITS/s_axi_aresetn] \
  [get_bd_pins D5M_OUTPUT/s_axi_aresetn] [get_bd_pins HDMI_OUTPUT/s_axi_aresetn] [get_bd_pins PS_VIDEO/M01_ARESETN]

# ---- address map ----
assign_bd_address -offset 0x41200000 -range 64K -target_address_space [get_bd_addr_spaces PS_VIDEO/PS/TO_PS/PS7/Data] [get_bd_addr_segs LEDS_8BITS/S_AXI/Reg]
assign_bd_address -offset 0x41210000 -range 64K -target_address_space [get_bd_addr_spaces PS_VIDEO/PS/TO_PS/PS7/Data] [get_bd_addr_segs DIP_SWITCHES_8BITS/S_AXI/Reg]
assign_bd_address -offset 0x41600000 -range 64K -target_address_space [get_bd_addr_spaces PS_VIDEO/PS/TO_PS/PS7/Data] [get_bd_addr_segs D5M_OUTPUT/D5M_IIC/S_AXI/Reg]
assign_bd_address -offset 0x41610000 -range 64K -target_address_space [get_bd_addr_spaces PS_VIDEO/PS/TO_PS/PS7/Data] [get_bd_addr_segs HDMI_OUTPUT/HDMI_IIC/S_AXI/Reg]
assign_bd_address -offset 0x43000000 -range 64K -target_address_space [get_bd_addr_spaces PS_VIDEO/PS/TO_PS/PS7/Data] [get_bd_addr_segs PS_VIDEO/PS/V_DMA/VDMA1/S_AXI_LITE/Reg]
assign_bd_address -offset 0x43C00000 -range 64K -target_address_space [get_bd_addr_spaces PS_VIDEO/PS/TO_PS/PS7/Data] [get_bd_addr_segs VIDEO_PIPELINE/TIMMING_CONTROLELR/ctrl/Reg]
assign_bd_address -offset 0x43C10000 -range 64K -target_address_space [get_bd_addr_spaces PS_VIDEO/PS/TO_PS/PS7/Data] [get_bd_addr_segs PS_VIDEO/D5M/videoProcess/config_axis/config_axis_reg]
assign_bd_address -offset 0x43C20000 -range 64K -target_address_space [get_bd_addr_spaces PS_VIDEO/PS/TO_PS/PS7/Data] [get_bd_addr_segs PS_VIDEO/PS/TO_PS/Sine_0/ctrl_saxi/ctrl_saxi_reg]
assign_bd_address -offset 0x00000000 -range 512M -target_address_space [get_bd_addr_spaces PS_VIDEO/PS/V_DMA/VDMA1/Data_MM2S] [get_bd_addr_segs PS_VIDEO/PS/TO_PS/PS7/S_AXI_HP0/HP0_DDR_LOWOCM]
assign_bd_address -offset 0x00000000 -range 512M -target_address_space [get_bd_addr_spaces PS_VIDEO/PS/V_DMA/VDMA1/Data_S2MM] [get_bd_addr_segs PS_VIDEO/PS/TO_PS/PS7/S_AXI_HP0/HP0_DDR_LOWOCM]

validate_bd_design
save_bd_design
